# Altium schematic sheet conn.SchDoc
size A3; SheetNumber: 2; SheetTotal: 3
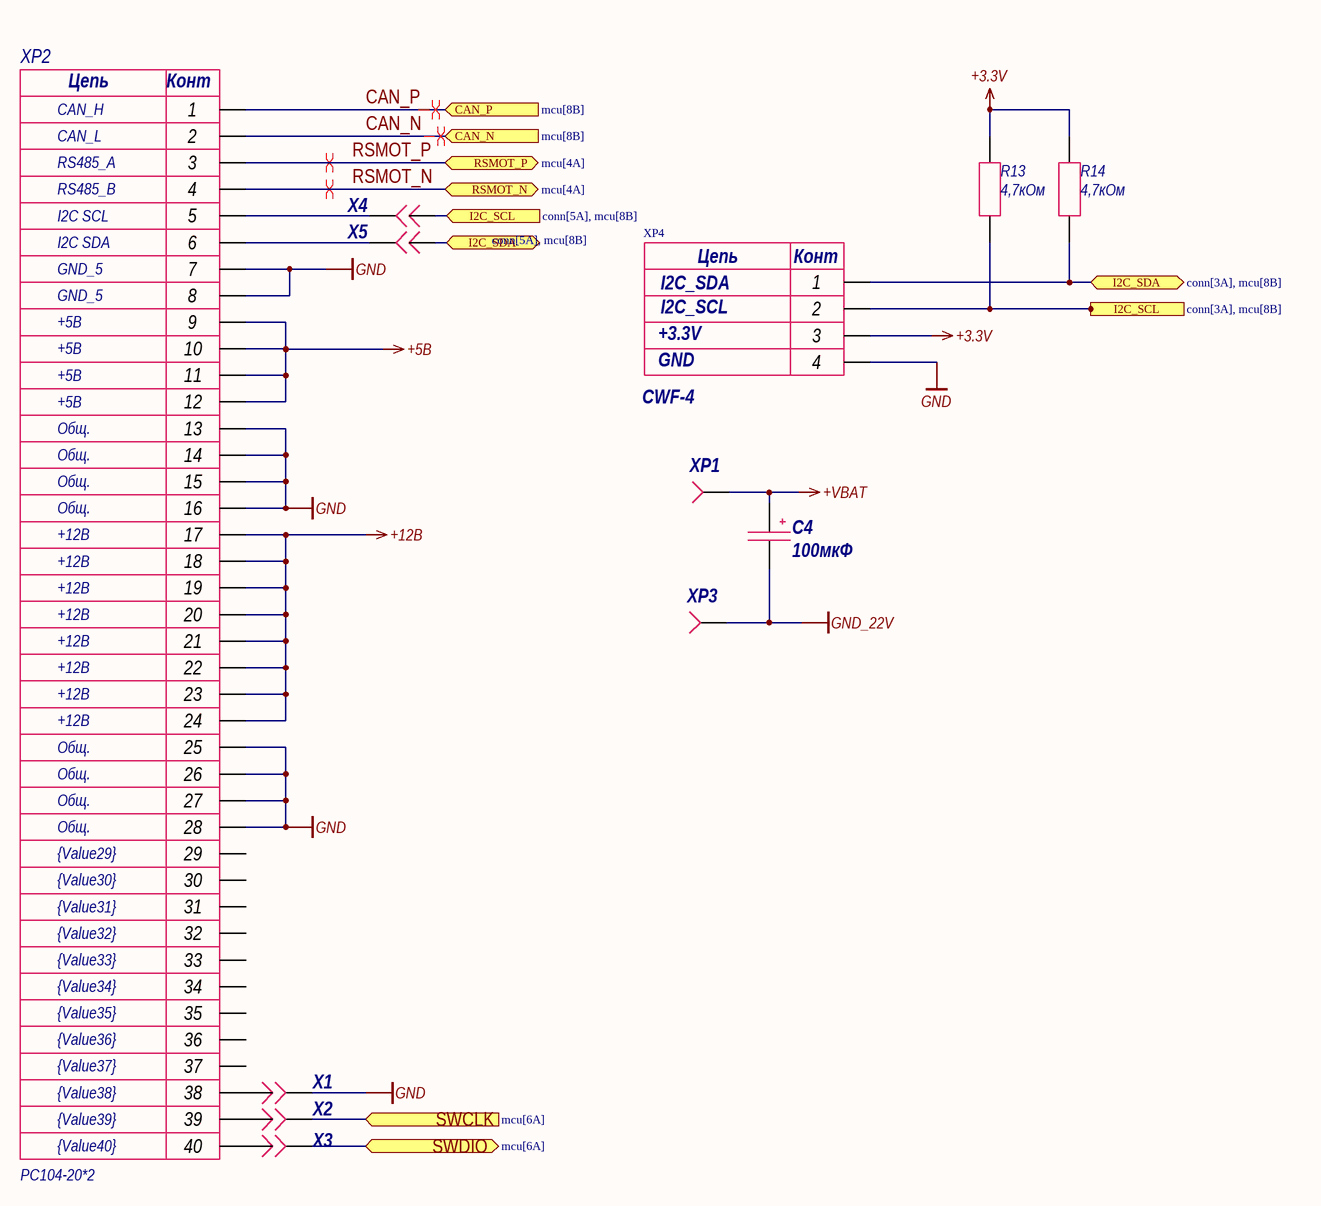
[diagram p0: conn.SchDoc]

## Parts
C4  value 100мкФ  [CAPPR65-350-1150X800X1250]  (hidden comment: 100uF)
R13  value 4,7кОм  [0603R]  (hidden comment: Resistor)
R14  value 4,7кОм  [0603R]  (hidden comment: Resistor)
X1  Jumper  [Fused Jumper]  (value not drawn)
X2  Jumper  [Fused Jumper]  (value not drawn)
X3  Jumper  [Fused Jumper]  (value not drawn)
X4  Jumper  [Fused Jumper]  (value not drawn)
X5  Jumper  [Fused Jumper]  (value not drawn)
XP1  номинал или название  [M3]  (value not drawn)
XP2  Value10: +5В  Value13: Общ.  Value17: +12В  Value1: CAN_H  Value2: CAN_L  Value3: RS485_A  Value4: RS485_B  Value5: I2C SCL  Value6: I2C SDA  Value7: GND_5  Value29: {Value29}  Value30: {Value30}  Value31: {Value31}  Value32: {Value32}  Value33: {Value33}  Value34: {Value34}  Value35: {Value35}  Value36: {Value36}  Value37: {Value37}  Value38: {Value38}  Value39: {Value39}  Value40: {Value40}  [PC - 104 20X2]  (hidden comment: PC104-20*2)
XP3  номинал или название  [M3]  (value not drawn)
XP4  Value1: I2C_SCL  Value2: I2C_SDA  Value3: +3.3V  Value4: GND  [CWF-4]  (hidden comment: CWF-4)

## Ports
CAN_N (in, see mcu[8B]), CAN_P (in, see mcu[8B]), I2C_SCL (in, see conn[5A], mcu[8B]), I2C_SCL (out, see conn[3A], mcu[8B]), I2C_SDA (bidir, see conn[3A], mcu[8B]), I2C_SDA (bidir, see conn[5A], mcu[8B]), RSMOT_N (bidir, see mcu[4A]), RSMOT_P (bidir, see mcu[4A]), SWCLK (in, see mcu[6A]), SWDIO (bidir, see mcu[6A])

## Nets
+3.3V: R13.1 R14.1 XP4.3
+5В: XP2.9 XP2.10 XP2.11 XP2.12
+12В: XP2.17 XP2.18 XP2.19 XP2.20 XP2.21 XP2.22 XP2.23 XP2.24
+VBAT: C4.1 XP1.1(M2,5)
GND: X1.1(M2,5) XP2.7 XP2.8 XP2.13 XP2.14 XP2.15 XP2.16 XP2.25 XP2.26 XP2.27 XP2.28 XP4.4
GND_22V: C4.2 XP3.1(M2,5)
CAN_N: XP2.2 ; port CAN_N
CAN_P: XP2.1 ; port CAN_P
I2C_SCL: R13.2 X4.2(M2,5) XP4.2 ; port I2C_SCL
I2C_SDA: R14.2 X5.2(M2,5) XP4.1 ; port I2C_SDA
RSMOT_N: XP2.4 ; port RSMOT_N
RSMOT_P: XP2.3 ; port RSMOT_P
SWCLK: X2.1(M2,5) ; port SWCLK
SWDIO: X3.1(M2,5) ; port SWDIO
NetX1_2: X1.2(M2,5) XP2.38
NetX2_2: X2.2(M2,5) XP2.39
NetX3_2: X3.2(M2,5) XP2.40
NetX4_1: X4.1(M2,5) XP2.5
NetX5_1: X5.1(M2,5) XP2.6

Not connected (* = marked no-connect by the designer): XP2 29 30 31 32 33 34 35 36 37

## Layout directives
differential pair: CAN_N, CAN_P, RSMOT_N, RSMOT_P

## Notes on the sheet
- (in symbol CWF-4) Цепь; Конт
- (in symbol PC104-20*2) Цепь; Конт

## Library data of the parts
C4 = Capacitor_pol_100uF: Shop: https://www.chipdip.ru/product0/9000565887
X1-X5 = Jumper: Manufacturer: производитель; Rate: уровень напряжений; Shop: магазин с самой дешевой ценой; Notice: перемычка; Datasheet: ссылка на даташит; Case: корпус
XP1 XP3 = 1pin: Manufacturer: производитель; Rate: уровень напряжений; Shop: магазин с самой дешевой ценой; Notice: примечания; Datasheet: ссылка на даташит; Case: корпус; Value: номинал или название
XP2 = PC104-20*2: Notice: PC104-40; Value: PC104-20*2; Value11: +5В; Value12: +5В; Value14: Общ.; Value15: Общ.; Value16: Общ.; Value18: +12В; Value8: GND_5; Value9: +5В; Value19: +12В; Value20: +12В; Value21: +12В; Value22: +12В; Value23: +12В; Value24: +12В; Value25: Общ.; Value26: Общ.; Value27: Общ.; Value28: Общ.
XP4 = CWF-4: Manufactore: Connfly; Notice: Вилка-мама 4 пина, шаг 2.5мм; Rate: 500В AC 1min; Case: корпус; Datasheet: https://lib.chipdip.ru/413/DOC001413777.pdf; Shop: https://www.chipdip.ru/product/cwf-4; Value: CWF-4